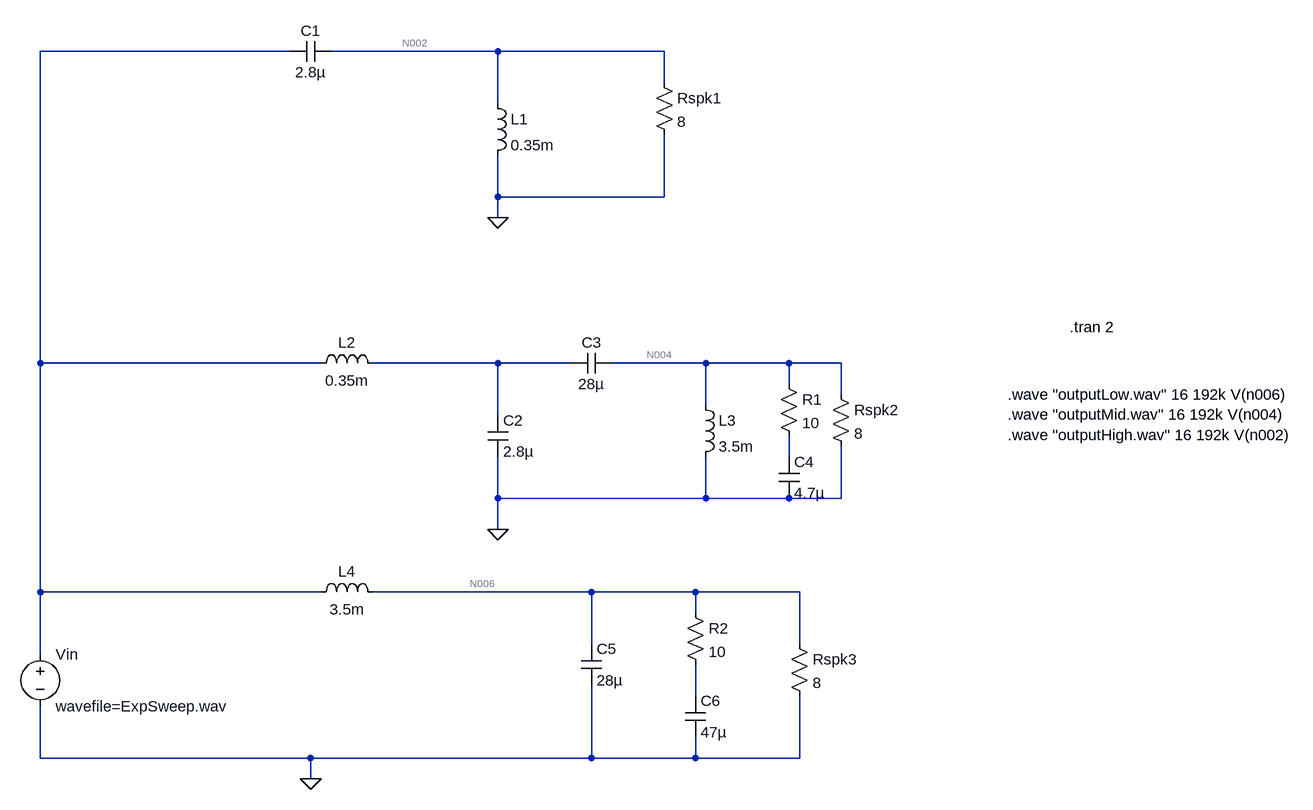
[diagram p0: schematic Crossover.asc]
Crossover.asc, the LTspice schematic file:
Version 4
SHEET 1 1740 720
WIRE 176 -416 -208 -416
WIRE 496 -416 240 -416
WIRE 752 -416 496 -416
WIRE 752 -368 752 -416
WIRE 496 -336 496 -416
WIRE 496 -192 496 -256
WIRE 752 -192 752 -288
WIRE 752 -192 496 -192
WIRE 496 -160 496 -192
WIRE -208 64 -208 -416
WIRE 224 64 -208 64
WIRE 496 64 304 64
WIRE 608 64 496 64
WIRE 816 64 672 64
WIRE 944 64 816 64
WIRE 1024 64 944 64
WIRE 944 96 944 64
WIRE 1024 112 1024 64
WIRE 816 128 816 64
WIRE 496 144 496 64
WIRE 944 208 944 176
WIRE 496 272 496 208
WIRE 816 272 816 208
WIRE 816 272 496 272
WIRE 944 272 816 272
WIRE 1024 272 1024 192
WIRE 1024 272 944 272
WIRE 496 320 496 272
WIRE -208 416 -208 64
WIRE 224 416 -208 416
WIRE 640 416 304 416
WIRE 800 416 640 416
WIRE 960 416 800 416
WIRE 800 448 800 416
WIRE 640 496 640 416
WIRE 960 496 960 416
WIRE -208 512 -208 416
WIRE 800 576 800 528
WIRE -208 672 -208 592
WIRE 208 672 -208 672
WIRE 640 672 640 560
WIRE 640 672 208 672
WIRE 800 672 800 640
WIRE 800 672 640 672
WIRE 960 672 960 576
WIRE 960 672 800 672
WIRE 208 704 208 672
FLAG 208 704 0
FLAG 496 -160 0
FLAG 496 320 0
SYMBOL res 944 480 R0
SYMATTR InstName Rspk3
SYMATTR Value 8
SYMBOL res 784 432 R0
SYMATTR InstName R2
SYMATTR Value 10
SYMBOL res 1008 96 R0
SYMATTR InstName Rspk2
SYMATTR Value 8
SYMBOL res 928 80 R0
SYMATTR InstName R1
SYMATTR Value 10
SYMBOL res 736 -384 R0
SYMATTR InstName Rspk1
SYMATTR Value 8
SYMBOL cap 624 496 R0
SYMATTR InstName C5
SYMATTR Value 28µ
SYMBOL cap 784 576 R0
SYMATTR InstName C6
SYMATTR Value 47µ
SYMBOL cap 928 208 R0
SYMATTR InstName C4
SYMATTR Value 4.7µ
SYMBOL cap 480 144 R0
SYMATTR InstName C2
SYMATTR Value 2.8µ
SYMBOL cap 608 80 R270
WINDOW 0 32 32 VTop 2
WINDOW 3 0 32 VBottom 2
SYMATTR InstName C3
SYMATTR Value 28µ
SYMBOL cap 176 -400 R270
WINDOW 0 32 32 VTop 2
WINDOW 3 0 32 VBottom 2
SYMATTR InstName C1
SYMATTR Value 2.8µ
SYMBOL ind 800 112 R0
SYMATTR InstName L3
SYMATTR Value 3.5m
SYMBOL ind 480 -352 R0
SYMATTR InstName L1
SYMATTR Value 0.35m
SYMBOL ind 208 80 R270
WINDOW 0 32 56 VTop 2
WINDOW 3 5 56 VBottom 2
SYMATTR InstName L2
SYMATTR Value 0.35m
SYMBOL ind 208 432 R270
WINDOW 0 32 56 VTop 2
WINDOW 3 5 56 VBottom 2
SYMATTR InstName L4
SYMATTR Value 3.5m
SYMBOL voltage -208 496 R0
SYMATTR InstName Vin
SYMATTR Value wavefile=ExpSweep.wav
TEXT 1376 8 Left 2 !.tran 2
TEXT 1280 112 Left 2 !.wave "outputLow.wav" 16 192k V(n006)\n.wave "outputMid.wav" 16 192k V(n004)\n.wave "outputHigh.wav" 16 192k V(n002)

The netlist it stands for:
* Crossover.asc
Rspk3 N006 0 8
R2 N006 N007 10
Rspk2 N004 0 8
R1 N004 N005 10
Rspk1 N002 0 8
C5 N006 0 28µ
C6 N007 0 47µ
C4 N005 0 4.7µ
C2 N003 0 2.8µ
C3 N003 N004 28µ
C1 N001 N002 2.8µ
L3 N004 0 3.5m
L1 N002 0 0.35m
L2 N001 N003 0.35m
L4 N001 N006 3.5m
Vin N001 0 wavefile=ExpSweep.wav
.tran 2
.wave "outputLow.wav" 16 192k V(n006)
.wave "outputMid.wav" 16 192k V(n004)
.wave "outputHigh.wav" 16 192k V(n002)
.backanno
.end